# Altium schematic sheet TK510_Kontakter.SchDoc
size A3; DocumentNumber: 5; SheetNumber: 5
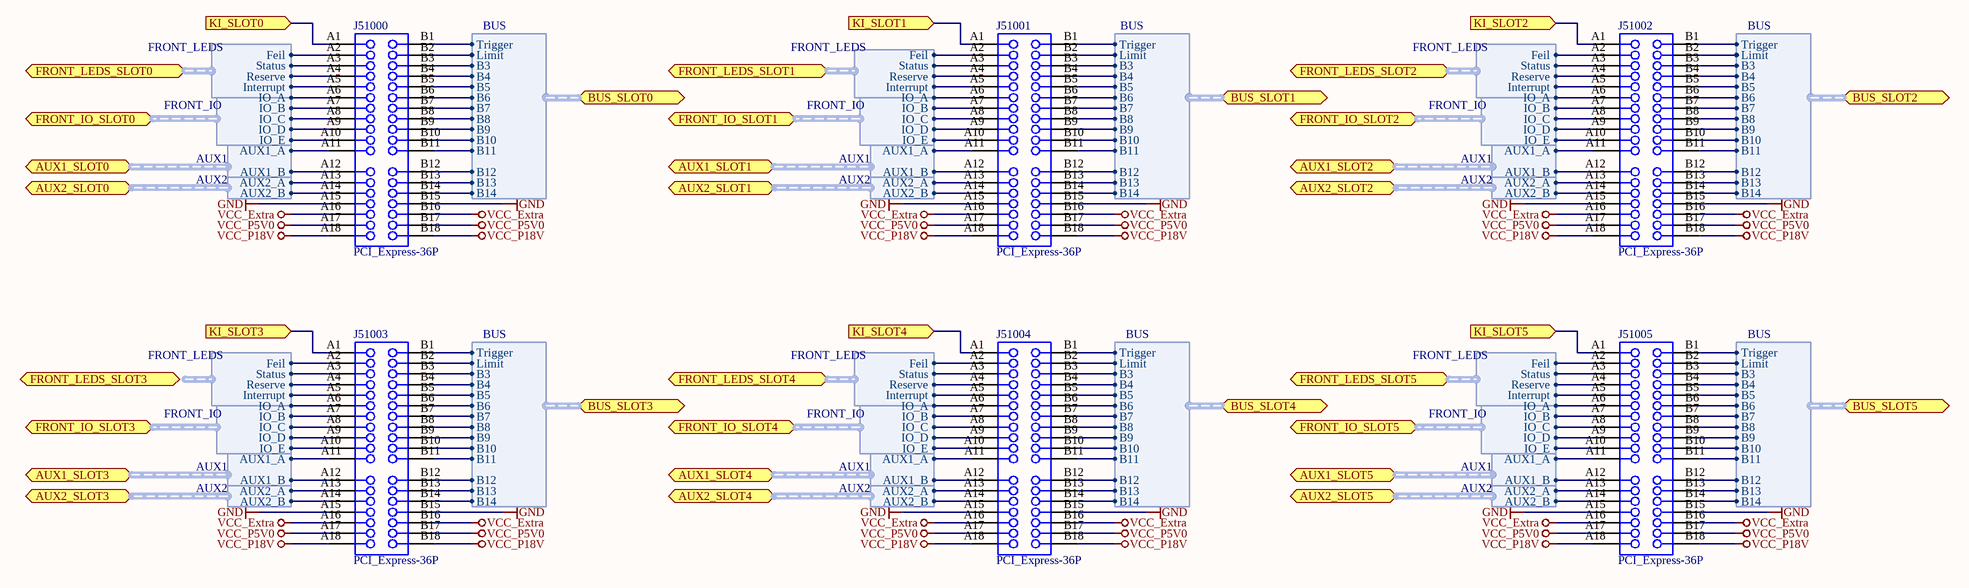
[diagram p0: TK510_Kontakter.SchDoc]

## Parts
J51000  PCI_Express-36P  [PCI_Express-36P]
J51001  PCI_Express-36P  [PCI_Express-36P]
J51002  PCI_Express-36P  [PCI_Express-36P]
J51003  PCI_Express-36P  [PCI_Express-36P]
J51004  PCI_Express-36P  [PCI_Express-36P]
J51005  PCI_Express-36P  [PCI_Express-36P]

## Ports
AUX1_SLOT0 (harness AUX1), AUX1_SLOT1 (harness AUX1), AUX1_SLOT2 (harness AUX1), AUX1_SLOT3 (harness AUX1), AUX1_SLOT4 (harness AUX1), AUX1_SLOT5 (harness AUX1), AUX2_SLOT0 (harness AUX2), AUX2_SLOT1 (harness AUX2), AUX2_SLOT2 (harness AUX2), AUX2_SLOT3 (harness AUX2), AUX2_SLOT4 (harness AUX2), AUX2_SLOT5 (harness AUX2), BUS_SLOT0 (harness BUS), BUS_SLOT1 (harness BUS), BUS_SLOT2 (harness BUS), BUS_SLOT3 (harness BUS), BUS_SLOT4 (harness BUS), BUS_SLOT5 (harness BUS), FRONT_IO_SLOT0 (harness FRONT_IO), FRONT_IO_SLOT1 (harness FRONT_IO), FRONT_IO_SLOT2 (harness FRONT_IO), FRONT_IO_SLOT3 (harness FRONT_IO), FRONT_IO_SLOT4 (harness FRONT_IO), FRONT_IO_SLOT5 (harness FRONT_IO), FRONT_LEDS_SLOT0 (harness FRONT_LEDS), FRONT_LEDS_SLOT1 (harness FRONT_LEDS), FRONT_LEDS_SLOT2 (harness FRONT_LEDS), FRONT_LEDS_SLOT3 (harness J51003), FRONT_LEDS_SLOT4 (harness FRONT_LEDS), FRONT_LEDS_SLOT5 (harness FRONT_LEDS), KI_SLOT0 (in), KI_SLOT1 (in), KI_SLOT2 (in), KI_SLOT3 (in), KI_SLOT4 (in), KI_SLOT5 (in)

## Harnesses
FRONT_LEDS: Feil, Status, Reserve, Interrupt
AUX2: AUX2_A, AUX2_B
AUX1: AUX1_A, AUX1_B
FRONT_IO: IO_A, IO_B, IO_C, IO_D, IO_E
BUS: Trigger, Limit, B3, B4, B5, B6, B7, B8, B9, B10, B11, B12, B13, B14

## Nets
GND: J51000.A15 J51000.B15 J51001.A15 J51001.B15 J51002.A15 J51002.B15 J51003.A15 J51003.B15 J51004.A15 J51004.B15 J51005.A15 J51005.B15
VCC_Extra: J51000.A16 J51000.B16 J51001.A16 J51001.B16 J51002.A16 J51002.B16 J51003.A16 J51003.B16 J51004.A16 J51004.B16 J51005.A16 J51005.B16
VCC_P5V0: J51000.A17 J51000.B17 J51001.A17 J51001.B17 J51002.A17 J51002.B17 J51003.A17 J51003.B17 J51004.A17 J51004.B17 J51005.A17 J51005.B17
VCC_P18V: J51000.A18 J51000.B18 J51001.A18 J51001.B18 J51002.A18 J51002.B18 J51003.A18 J51003.B18 J51004.A18 J51004.B18 J51005.A18 J51005.B18
KI_SLOT0: J51000.A1 ; port KI_SLOT0
KI_SLOT1: J51001.A1 ; port KI_SLOT1
KI_SLOT2: J51002.A1 ; port KI_SLOT2
KI_SLOT3: J51003.A1 ; port KI_SLOT3
KI_SLOT4: J51004.A1 ; port KI_SLOT4
KI_SLOT5: J51005.A1 ; port KI_SLOT5
NetJ51000_A2: J51000.A2 ; port FRONT_LEDS_SLOT0.Feil
NetJ51000_A3: J51000.A3 ; port FRONT_LEDS_SLOT0.Status
NetJ51000_A4: J51000.A4 ; port FRONT_LEDS_SLOT0.Reserve
NetJ51000_A5: J51000.A5 ; port FRONT_LEDS_SLOT0.Interrupt
NetJ51000_A6: J51000.A6 ; port FRONT_IO_SLOT0.IO_A
NetJ51000_A7: J51000.A7 ; port FRONT_IO_SLOT0.IO_B
NetJ51000_A8: J51000.A8 ; port FRONT_IO_SLOT0.IO_C
NetJ51000_A9: J51000.A9 ; port FRONT_IO_SLOT0.IO_D
NetJ51000_A10: J51000.A10 ; port FRONT_IO_SLOT0.IO_E
NetJ51000_A11: J51000.A11 ; port AUX1_SLOT0.AUX1_A
NetJ51000_A12: J51000.A12 ; port AUX1_SLOT0.AUX1_B
NetJ51000_A13: J51000.A13 ; port AUX2_SLOT0.AUX2_A
NetJ51000_A14: J51000.A14 ; port AUX2_SLOT0.AUX2_B
NetJ51000_B1: J51000.B1 ; port BUS_SLOT0.Trigger
NetJ51000_B2: J51000.B2 ; port BUS_SLOT0.Limit
NetJ51000_B3: J51000.B3 ; port BUS_SLOT0.B3
NetJ51000_B4: J51000.B4 ; port BUS_SLOT0.B4
NetJ51000_B5: J51000.B5 ; port BUS_SLOT0.B5
NetJ51000_B6: J51000.B6 ; port BUS_SLOT0.B6
NetJ51000_B7: J51000.B7 ; port BUS_SLOT0.B7
NetJ51000_B8: J51000.B8 ; port BUS_SLOT0.B8
NetJ51000_B9: J51000.B9 ; port BUS_SLOT0.B9
NetJ51000_B10: J51000.B10 ; port BUS_SLOT0.B10
NetJ51000_B11: J51000.B11 ; port BUS_SLOT0.B11
NetJ51000_B12: J51000.B12 ; port BUS_SLOT0.B12
NetJ51000_B13: J51000.B13 ; port BUS_SLOT0.B13
NetJ51000_B14: J51000.B14 ; port BUS_SLOT0.B14
NetJ51001_A2: J51001.A2 ; port FRONT_LEDS_SLOT1.Feil
NetJ51001_A3: J51001.A3 ; port FRONT_LEDS_SLOT1.Status
NetJ51001_A4: J51001.A4 ; port FRONT_LEDS_SLOT1.Reserve
NetJ51001_A5: J51001.A5 ; port FRONT_LEDS_SLOT1.Interrupt
NetJ51001_A6: J51001.A6 ; port FRONT_IO_SLOT1.IO_A
NetJ51001_A7: J51001.A7 ; port FRONT_IO_SLOT1.IO_B
NetJ51001_A8: J51001.A8 ; port FRONT_IO_SLOT1.IO_C
NetJ51001_A9: J51001.A9 ; port FRONT_IO_SLOT1.IO_D
NetJ51001_A10: J51001.A10 ; port FRONT_IO_SLOT1.IO_E
NetJ51001_A11: J51001.A11 ; port AUX1_SLOT1.AUX1_A
NetJ51001_A12: J51001.A12 ; port AUX1_SLOT1.AUX1_B
NetJ51001_A13: J51001.A13 ; port AUX2_SLOT1.AUX2_A
NetJ51001_A14: J51001.A14 ; port AUX2_SLOT1.AUX2_B
NetJ51001_B1: J51001.B1 ; port BUS_SLOT1.Trigger
NetJ51001_B2: J51001.B2 ; port BUS_SLOT1.Limit
NetJ51001_B3: J51001.B3 ; port BUS_SLOT1.B3
NetJ51001_B4: J51001.B4 ; port BUS_SLOT1.B4
NetJ51001_B5: J51001.B5 ; port BUS_SLOT1.B5
NetJ51001_B6: J51001.B6 ; port BUS_SLOT1.B6
NetJ51001_B7: J51001.B7 ; port BUS_SLOT1.B7
NetJ51001_B8: J51001.B8 ; port BUS_SLOT1.B8
NetJ51001_B9: J51001.B9 ; port BUS_SLOT1.B9
NetJ51001_B10: J51001.B10 ; port BUS_SLOT1.B10
NetJ51001_B11: J51001.B11 ; port BUS_SLOT1.B11
NetJ51001_B12: J51001.B12 ; port BUS_SLOT1.B12
NetJ51001_B13: J51001.B13 ; port BUS_SLOT1.B13
NetJ51001_B14: J51001.B14 ; port BUS_SLOT1.B14
NetJ51002_A2: J51002.A2 ; port FRONT_LEDS_SLOT2.Feil
NetJ51002_A3: J51002.A3 ; port FRONT_LEDS_SLOT2.Status
NetJ51002_A4: J51002.A4 ; port FRONT_LEDS_SLOT2.Reserve
NetJ51002_A5: J51002.A5 ; port FRONT_LEDS_SLOT2.Interrupt
NetJ51002_A6: J51002.A6 ; port FRONT_IO_SLOT2.IO_A
NetJ51002_A7: J51002.A7 ; port FRONT_IO_SLOT2.IO_B
NetJ51002_A8: J51002.A8 ; port FRONT_IO_SLOT2.IO_C
NetJ51002_A9: J51002.A9 ; port FRONT_IO_SLOT2.IO_D
NetJ51002_A10: J51002.A10 ; port FRONT_IO_SLOT2.IO_E
NetJ51002_A11: J51002.A11 ; port AUX1_SLOT2.AUX1_A
NetJ51002_A12: J51002.A12 ; port AUX1_SLOT2.AUX1_B
NetJ51002_A13: J51002.A13 ; port AUX2_SLOT2.AUX2_A
NetJ51002_A14: J51002.A14 ; port AUX2_SLOT2.AUX2_B
NetJ51002_B1: J51002.B1 ; port BUS_SLOT2.Trigger
NetJ51002_B2: J51002.B2 ; port BUS_SLOT2.Limit
NetJ51002_B3: J51002.B3 ; port BUS_SLOT2.B3
NetJ51002_B4: J51002.B4 ; port BUS_SLOT2.B4
NetJ51002_B5: J51002.B5 ; port BUS_SLOT2.B5
NetJ51002_B6: J51002.B6 ; port BUS_SLOT2.B6
NetJ51002_B7: J51002.B7 ; port BUS_SLOT2.B7
NetJ51002_B8: J51002.B8 ; port BUS_SLOT2.B8
NetJ51002_B9: J51002.B9 ; port BUS_SLOT2.B9
NetJ51002_B10: J51002.B10 ; port BUS_SLOT2.B10
NetJ51002_B11: J51002.B11 ; port BUS_SLOT2.B11
NetJ51002_B12: J51002.B12 ; port BUS_SLOT2.B12
NetJ51002_B13: J51002.B13 ; port BUS_SLOT2.B13
NetJ51002_B14: J51002.B14 ; port BUS_SLOT2.B14
NetJ51003_A2: J51003.A2 ; harness FRONT_LEDS.Feil
NetJ51003_A3: J51003.A3 ; harness FRONT_LEDS.Status
NetJ51003_A4: J51003.A4 ; harness FRONT_LEDS.Reserve
NetJ51003_A5: J51003.A5 ; harness FRONT_LEDS.Interrupt
NetJ51003_A6: J51003.A6 ; port FRONT_IO_SLOT3.IO_A
NetJ51003_A7: J51003.A7 ; port FRONT_IO_SLOT3.IO_B
NetJ51003_A8: J51003.A8 ; port FRONT_IO_SLOT3.IO_C
NetJ51003_A9: J51003.A9 ; port FRONT_IO_SLOT3.IO_D
NetJ51003_A10: J51003.A10 ; port FRONT_IO_SLOT3.IO_E
NetJ51003_A11: J51003.A11 ; port AUX1_SLOT3.AUX1_A
NetJ51003_A12: J51003.A12 ; port AUX1_SLOT3.AUX1_B
NetJ51003_A13: J51003.A13 ; port AUX2_SLOT3.AUX2_A
NetJ51003_A14: J51003.A14 ; port AUX2_SLOT3.AUX2_B
NetJ51003_B1: J51003.B1 ; port BUS_SLOT3.Trigger
NetJ51003_B2: J51003.B2 ; port BUS_SLOT3.Limit
NetJ51003_B3: J51003.B3 ; port BUS_SLOT3.B3
NetJ51003_B4: J51003.B4 ; port BUS_SLOT3.B4
NetJ51003_B5: J51003.B5 ; port BUS_SLOT3.B5
NetJ51003_B6: J51003.B6 ; port BUS_SLOT3.B6
NetJ51003_B7: J51003.B7 ; port BUS_SLOT3.B7
NetJ51003_B8: J51003.B8 ; port BUS_SLOT3.B8
NetJ51003_B9: J51003.B9 ; port BUS_SLOT3.B9
NetJ51003_B10: J51003.B10 ; port BUS_SLOT3.B10
NetJ51003_B11: J51003.B11 ; port BUS_SLOT3.B11
NetJ51003_B12: J51003.B12 ; port BUS_SLOT3.B12
NetJ51003_B13: J51003.B13 ; port BUS_SLOT3.B13
NetJ51003_B14: J51003.B14 ; port BUS_SLOT3.B14
NetJ51004_A2: J51004.A2 ; port FRONT_LEDS_SLOT4.Feil
NetJ51004_A3: J51004.A3 ; port FRONT_LEDS_SLOT4.Status
NetJ51004_A4: J51004.A4 ; port FRONT_LEDS_SLOT4.Reserve
NetJ51004_A5: J51004.A5 ; port FRONT_LEDS_SLOT4.Interrupt
NetJ51004_A6: J51004.A6 ; port FRONT_IO_SLOT4.IO_A
NetJ51004_A7: J51004.A7 ; port FRONT_IO_SLOT4.IO_B
NetJ51004_A8: J51004.A8 ; port FRONT_IO_SLOT4.IO_C
NetJ51004_A9: J51004.A9 ; port FRONT_IO_SLOT4.IO_D
NetJ51004_A10: J51004.A10 ; port FRONT_IO_SLOT4.IO_E
NetJ51004_A11: J51004.A11 ; port AUX1_SLOT4.AUX1_A
NetJ51004_A12: J51004.A12 ; port AUX1_SLOT4.AUX1_B
NetJ51004_A13: J51004.A13 ; port AUX2_SLOT4.AUX2_A
NetJ51004_A14: J51004.A14 ; port AUX2_SLOT4.AUX2_B
NetJ51004_B1: J51004.B1 ; port BUS_SLOT4.Trigger
NetJ51004_B2: J51004.B2 ; port BUS_SLOT4.Limit
NetJ51004_B3: J51004.B3 ; port BUS_SLOT4.B3
NetJ51004_B4: J51004.B4 ; port BUS_SLOT4.B4
NetJ51004_B5: J51004.B5 ; port BUS_SLOT4.B5
NetJ51004_B6: J51004.B6 ; port BUS_SLOT4.B6
NetJ51004_B7: J51004.B7 ; port BUS_SLOT4.B7
NetJ51004_B8: J51004.B8 ; port BUS_SLOT4.B8
NetJ51004_B9: J51004.B9 ; port BUS_SLOT4.B9
NetJ51004_B10: J51004.B10 ; port BUS_SLOT4.B10
NetJ51004_B11: J51004.B11 ; port BUS_SLOT4.B11
NetJ51004_B12: J51004.B12 ; port BUS_SLOT4.B12
NetJ51004_B13: J51004.B13 ; port BUS_SLOT4.B13
NetJ51004_B14: J51004.B14 ; port BUS_SLOT4.B14
NetJ51005_A2: J51005.A2 ; port FRONT_LEDS_SLOT5.Feil
NetJ51005_A3: J51005.A3 ; port FRONT_LEDS_SLOT5.Status
NetJ51005_A4: J51005.A4 ; port FRONT_LEDS_SLOT5.Reserve
NetJ51005_A5: J51005.A5 ; port FRONT_LEDS_SLOT5.Interrupt
NetJ51005_A6: J51005.A6 ; port FRONT_IO_SLOT5.IO_A
NetJ51005_A7: J51005.A7 ; port FRONT_IO_SLOT5.IO_B
NetJ51005_A8: J51005.A8 ; port FRONT_IO_SLOT5.IO_C
NetJ51005_A9: J51005.A9 ; port FRONT_IO_SLOT5.IO_D
NetJ51005_A10: J51005.A10 ; port FRONT_IO_SLOT5.IO_E
NetJ51005_A11: J51005.A11 ; port AUX1_SLOT5.AUX1_A
NetJ51005_A12: J51005.A12 ; port AUX1_SLOT5.AUX1_B
NetJ51005_A13: J51005.A13 ; port AUX2_SLOT5.AUX2_A
NetJ51005_A14: J51005.A14 ; port AUX2_SLOT5.AUX2_B
NetJ51005_B1: J51005.B1 ; port BUS_SLOT5.Trigger
NetJ51005_B2: J51005.B2 ; port BUS_SLOT5.Limit
NetJ51005_B3: J51005.B3 ; port BUS_SLOT5.B3
NetJ51005_B4: J51005.B4 ; port BUS_SLOT5.B4
NetJ51005_B5: J51005.B5 ; port BUS_SLOT5.B5
NetJ51005_B6: J51005.B6 ; port BUS_SLOT5.B6
NetJ51005_B7: J51005.B7 ; port BUS_SLOT5.B7
NetJ51005_B8: J51005.B8 ; port BUS_SLOT5.B8
NetJ51005_B9: J51005.B9 ; port BUS_SLOT5.B9
NetJ51005_B10: J51005.B10 ; port BUS_SLOT5.B10
NetJ51005_B11: J51005.B11 ; port BUS_SLOT5.B11
NetJ51005_B12: J51005.B12 ; port BUS_SLOT5.B12
NetJ51005_B13: J51005.B13 ; port BUS_SLOT5.B13
NetJ51005_B14: J51005.B14 ; port BUS_SLOT5.B14

## Library data of the parts
J51000-J51005 = PCI_Express-36P: Board-to-Board Connector, PTH, Vertical, Pitch 1.00mm, 36-Position; pakke_opprettet_av: 815; leverandor_varenr: 1144435; pris: 16; nokkelord: Card-edge; pakketype: 92; produsent: FCI; leverandor: Farnell; navn: PCI_Express-36P; pakke_opprettet: 06.07.2014 17:26:47; symbol_opprettet_av: 815; symbol_opprettet: 06.07.2014 17:26:37; beskrivelse: PCI_Express-36P